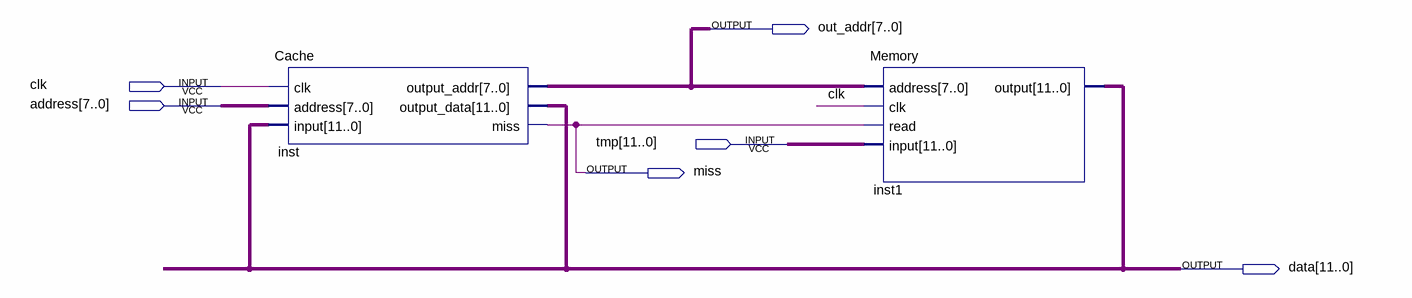
[diagram p0: schematic sheet]
// Quartus schematic Block1.bdf as structural Verilog: 2 symbols, 6 pins
module Block1 (
  input  clk,
  input  [7:0] address,
  input  [11:0] tmp,
  output [7:0] out_addr,
  output miss,
  output [11:0] data
);

  Cache inst (.clk(clk), .address(address), .\input (data), .output_addr(out_addr), .output_data(data), .miss(miss));
  Memory inst1 (.address(out_addr), .clk(clk), .read(miss), .\input (tmp), .\output (data));
endmodule
